# Altium schematic sheet adc_thermocouple.SchDoc
size A
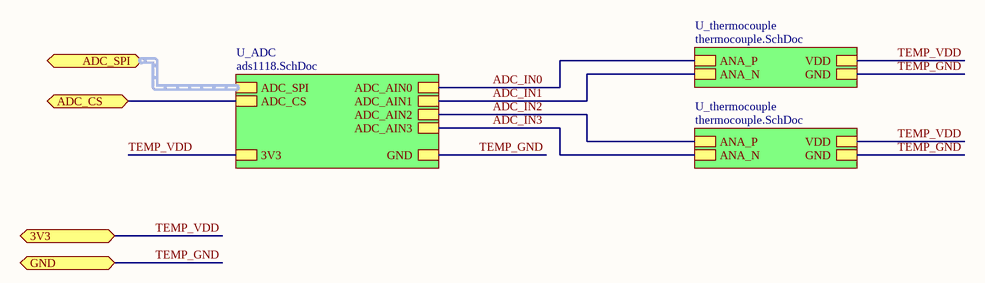
[diagram p0: adc_thermocouple.SchDoc]

## Sub-sheets
U_ADC = ads1118.SchDoc: ADC_SPI (harness SPI0), 3V3, GND, ADC_AIN0, ADC_AIN1, ADC_AIN2, ADC_AIN3, ADC_CS
U_thermocouple = thermocouple.SchDoc: ANA_P, ANA_N, VDD, GND
U_thermocouple = thermocouple.SchDoc: ANA_P, ANA_N, VDD, GND

## Ports
3V3, ADC_CS, ADC_SPI (harness SPI0), GND

## Nets
ADC_CS: port ADC_CS, sheet U_ADC/ADC_CS
ADC_IN0: sheet U_ADC/ADC_AIN0, sheet U_thermocouple/ANA_P
ADC_IN1: sheet U_ADC/ADC_AIN1, sheet U_thermocouple/ANA_N
ADC_IN2: sheet U_ADC/ADC_AIN2, sheet U_thermocouple/ANA_P
ADC_IN3: sheet U_ADC/ADC_AIN3, sheet U_thermocouple/ANA_N
TEMP_GND: port GND, sheet U_ADC/GND, sheet U_thermocouple/GND, sheet U_thermocouple/GND
TEMP_VDD: port 3V3, sheet U_ADC/3V3, sheet U_thermocouple/VDD, sheet U_thermocouple/VDD

## Buses and harness runs
harness port ADC_SPI = sheet U_ADC/ADC_SPI